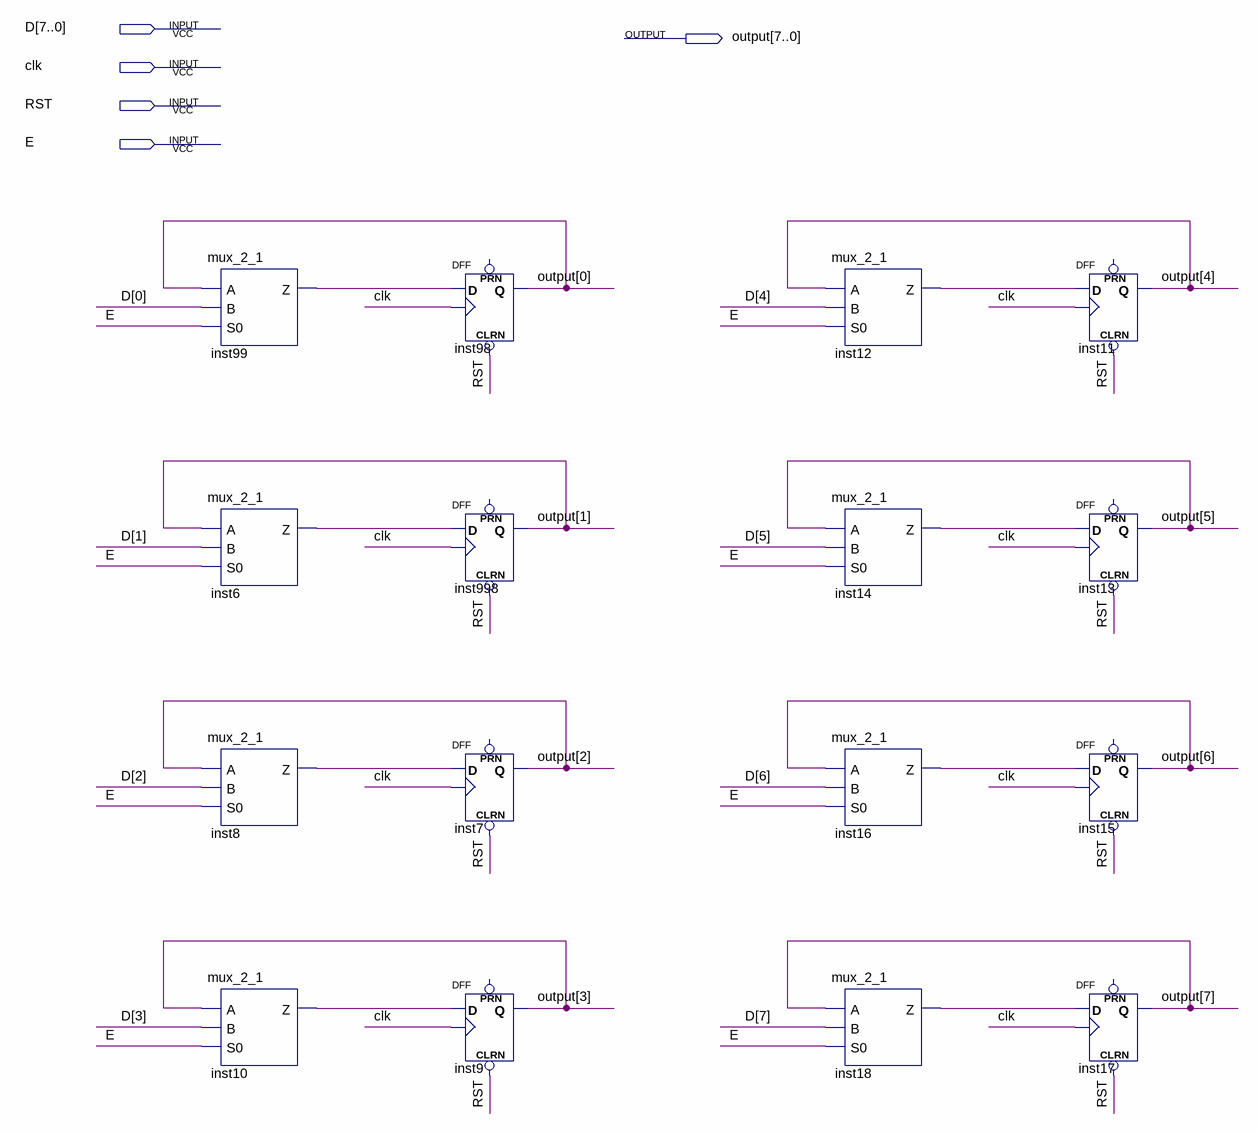
[diagram p0: schematic sheet]
// Quartus schematic REG_8b.bdf as structural Verilog: 16 symbols, 5 pins
module REG_8b (
  input  [7:0] D,
  input  clk,
  input  RST,
  input  E,
  output [7:0] \output 
);

  wire inst6_z, inst8_z, inst10_z, inst12_z, inst14_z, inst16_z, inst18_z, inst99_z;

  mux_2_1 inst99 (.A(\output [0]), .B(D[0]), .S0(E), .Z(inst99_z));
  mux_2_1 inst6 (.A(\output [1]), .B(D[1]), .S0(E), .Z(inst6_z));
  mux_2_1 inst8 (.A(\output [2]), .B(D[2]), .S0(E), .Z(inst8_z));
  mux_2_1 inst10 (.A(\output [3]), .B(D[3]), .S0(E), .Z(inst10_z));
  DFF inst98 (.CLRN(RST), .CLK(clk), .D(inst99_z), .Q(\output [0]));  // open: PRN
  DFF inst998 (.CLRN(RST), .CLK(clk), .D(inst6_z), .Q(\output [1]));  // open: PRN
  DFF inst7 (.CLRN(RST), .CLK(clk), .D(inst8_z), .Q(\output [2]));  // open: PRN
  DFF inst9 (.CLRN(RST), .CLK(clk), .D(inst10_z), .Q(\output [3]));  // open: PRN
  mux_2_1 inst12 (.A(\output [4]), .B(D[4]), .S0(E), .Z(inst12_z));
  mux_2_1 inst14 (.A(\output [5]), .B(D[5]), .S0(E), .Z(inst14_z));
  mux_2_1 inst16 (.A(\output [6]), .B(D[6]), .S0(E), .Z(inst16_z));
  mux_2_1 inst18 (.A(\output [7]), .B(D[7]), .S0(E), .Z(inst18_z));
  DFF inst11 (.CLRN(RST), .CLK(clk), .D(inst12_z), .Q(\output [4]));  // open: PRN
  DFF inst13 (.CLRN(RST), .CLK(clk), .D(inst14_z), .Q(\output [5]));  // open: PRN
  DFF inst15 (.CLRN(RST), .CLK(clk), .D(inst16_z), .Q(\output [6]));  // open: PRN
  DFF inst17 (.CLRN(RST), .CLK(clk), .D(inst18_z), .Q(\output [7]));  // open: PRN
endmodule
